# Altium schematic sheet Zasilanie.SchDoc
size 292 x 193 mm; SPICEModelCacheTYRFPEPP: <root> / <DocumentId>TYRFPEPP</DocumentId> / </root>; Opracowal: Krzysztof Dobosz; projRevision: MM; Author: Krzysztof Dobosz; CompanyName: Politechnika Warszawska; Organization: EITI; Address1: Nowowiejska 15/19; Address2: 00-665 Warszawa; Revision: MM; SheetNumber: 5; SheetTotal: 8; HTTPLink: www.pw.edu.pl
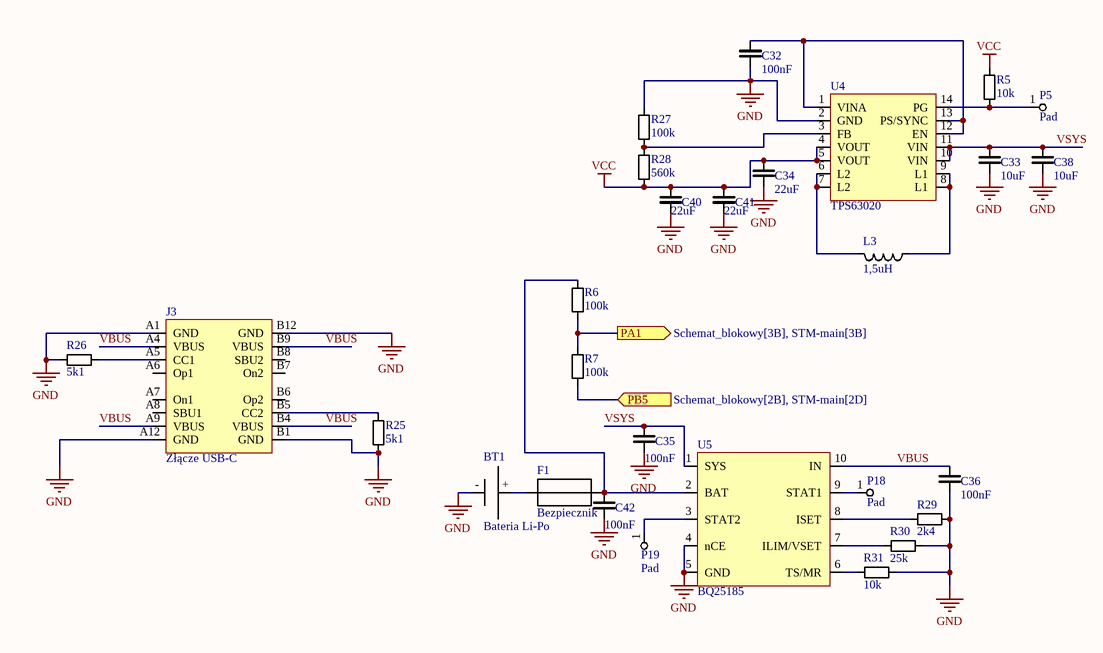
[diagram p0: Zasilanie.SchDoc]

## Parts
BT1  Bateria Li-Po  [LP623255 3,7V 1100mAh]  (net tie)
C32  100nF  [0603_CAP]
C33  10uF  [0603_CAP]
C34  22uF  [0603_CAP]
C35  100nF  [0603_CAP]
C36  100nF  [0603_CAP]
C38  10uF  [0603_CAP]
C40  22uF  [0603_CAP]
C41  22uF  [0603_CAP]
C42  100nF  [0603_CAP]
F1  Bezpiecznik  [0603_FUSE]
J3  Złącze USB-C  [HRO_TYPE-C-31-M-12]
L3  1,5uH  [0603_IND]
P5  Pad  [pad]  (no BOM)
P18  Pad  [pad]  (no BOM)
P19  Pad  [pad]  (no BOM)
R5  10k  [0603_RES]
R6  100k  [0603_RES]
R7  100k  [0603_RES]
R25  5k1  [0603_RES]
R26  5k1  [0603_RES]
R27  100k  [0603_RES]
R28  560k  [0603_RES]
R29  2k4  [0603_RES]
R30  25k  [0603_RES]
R31  10k  [0603_RES]
U4  TPS63020  [IC_TPS63020DSJT]
U5  BQ25185  [SON50P250X250X80-11N]

## Ports
PA1 (out, see Schemat_blokowy[3B], STM-main[3B]), PB5 (in, see Schemat_blokowy[2B], STM-main[2D])

## Nets
GND: BT1.- C32.1 C33.1 C34.1 C35.1 C36.1 C38.1 C40.1 C41.1 C42.1 J3.A1(GND) J3.A12(GND) J3.B1(GND) J3.B12(GND) R25.1 R26.2 R27.2 R29.2 R30.2 R31.1 U4.2(GND) U5.4(nCE) U5.5(GND)
VCC: C34.2 C40.2 C41.2 R5.2 R28.1 U4.4(VOUT) U4.5(VOUT)
PA1: R6.1 R7.2 ; port PA1
PB5: R7.1 ; port PB5
VBUS: C36.2 J3.A4(VBUS) J3.A9(VBUS) J3.B4(VBUS) J3.B9(VBUS) U5.10(IN)
VSYS: C33.2 C35.2 C38.2 U4.10(VIN) U4.11(VIN) U5.1(SYS)
NetBT1_+: BT1.+ F1.1
NetC32_2: C32.2 U4.1(VINA) U4.12(EN) U4.13(PS/SYNC)
NetC42_2: C42.2 F1.2 R6.2 U5.2(BAT)
NetJ3_A5: J3.A5(CC1) R26.1
NetJ3_B5: J3.B5(CC2) R25.2
NetL3_1: L3.1 U4.8(L1) U4.9(L1)
NetL3_2: L3.2 U4.6(L2) U4.7(L2)
NetP5_1: P5.1 R5.1 U4.14(PG)
NetP18_1: P18.1 U5.9(STAT1)
NetP19_1: P19.1 U5.3(STAT2)
NetR27_1: R27.1 R28.2 U4.3(FB)
NetR29_1: R29.1 U5.8(ISET)
NetR30_1: R30.1 U5.7(ILIM/VSET)
NetR31_2: R31.2 U5.6(TS/MR)

Not connected (* = marked no-connect by the designer): J3 A6(Op1) A7(On1) A8(SBU1) B6(Op2) B7(On2) B8(SBU2)

## Notes on the sheet
- Data:
- Tytuł:
- Rev.:
- Rozm.:
- A4
- Strona:
- z
- PBL4
- Opracował:

## Library data of the parts
C32-C36 C38 C40-C42 = Cap: Ceramic capacitor
  C32 C35 C36 C42: Value: 100nF
  C33 C38: Value: 10uF
  C34 C40 C41: Value: 22uF
F1 = Bezpiecznik: PartNumber: FMC16132WBTP; Link: https://www.digikey.pl/en/products/detail/kamaya-inc/FMC16132WBTP/15181255?_gl=1*1dq3pzm*_up*MQ..*_gs*MQ..&gclid=Cj0KCQjwqcO_BhDaARIsACz62vPoBc739cp1REhPwRacIq9Hmi_6DHVVJt4UIt_29A6Hw2SO46MFMW8aApgZEALw_wcB&gclsrc=aw.ds
J3 = Zlacze USB-C: PartNumber: 1332645; Link: https://www.digikey.pl/en/products/detail/phoenix-contact/1332645/17939578?fbclid=IwZXh0bgNhZW0CMTEAAR4Mdx9K9mJtLriTlYBZWbvmrlnITj3LSQ6iRN-YLuJkxgkM2rs57scEXE8Y3Q_aem_wESm8VjYaC4rfR53j8jRMw
L3 = Inductor: PartNumber: LSCNB1608HKT1R5MD; Value: 1,5uH; Link: https://www.digikey.pl/en/products/detail/taiyo-yuden/LSCNB1608HKT1R5MD/16667727?_gl=1%2A13aiihm%2A_up%2AMQ..%2A_gs%2AMQ..&gclid=Cj0KCQjwqcO_BhDaARIsACz62vPoBc739cp1REhPwRacIq9Hmi_6DHVVJt4UIt_29A6Hw2SO46MFMW8aApgZEALw_wcB&gclsrc=aw.ds&fbclid=IwZXh0bgNhZW0CMTEAAR5Hn44r6Y2tzqTa524hLU7tYgTtQnsMOIJjjoEy5tsCrLoSHtHj1OLLqk7kUg_aem_Mnh3PQQOy2cwiP9hppDfXg
R5-R7 R25-R31 = RES: Resistor
  R5 R31: Value: 10k
  R6 R7 R27: Value: 100k
  R25 R26: Value: 5k1
  R28: Value: 560k
  R29: Value: 2k4
  R30: Value: 25k
U4 = Stabilizator napięcia: Przetwornica impulsowa; PartNumber: TPS63020DSJR; Link: https://www.digikey.pl/en/products/detail/texas-instruments/TPS63020DSJR/2353761
U5 = BQ25185: Battery charger; PartNumber: BQ25185DLHR; Link: https://www.digikey.pl/en/products/detail/texas-instruments/BQ25185DLHR/21769368?s=N4IgTCBcDaIEIEUwFYCMAOZIC6BfIA
BT1 = Bateria Li-Po: PartNumber: LP623255 3,7V 1100mAh